# EAGLE design gps (EAGLE 6.2)
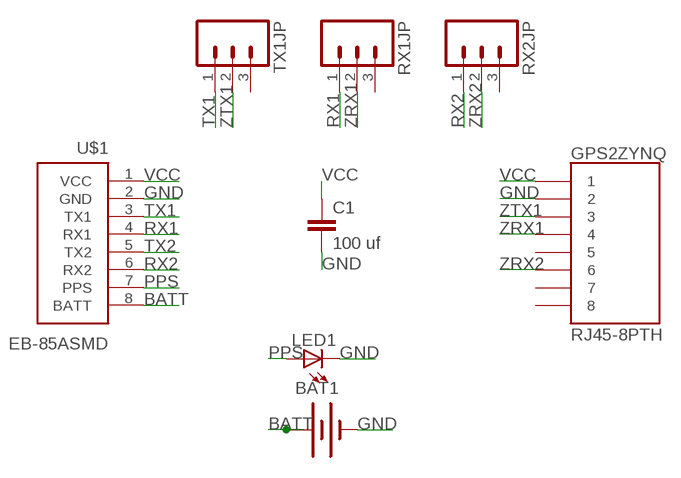
[diagram p0: schematic, sheet 1]

## Parts
BAT1  BATTERY12PTH  [BATTCON_12MM_PTH]
C1  100 uf  CAPPTH1  [CAP-PTH-5MM]
GPS2ZYNQ  RJ45-8PTH  [RJ45-8]
LED1  LED5MM  [LED5MM]
RX1JP  M03LONGPADS  [1X03_LONGPADS]
RX2JP  M03LONGPADS  [1X03_LONGPADS]
TX1JP  M03LONGPADS  [1X03_LONGPADS]
U$1  EB-85ASMD  [EB-85A]

## Nets
BATT: BAT1.VCC@1(+) U$1.8(BATT)
GND: BAT1.GND(-) C1.2 GPS2ZYNQ.2 LED1.K(C) U$1.2(GND)
PPS: LED1.A U$1.7(PPS)
RX1: RX1JP.1 U$1.4(RX1)
RX2: RX2JP.1 U$1.6(RX2)
TX1: TX1JP.1 U$1.3(TX1)
TX2: U$1.5(TX2)
VCC: C1.1 GPS2ZYNQ.1 U$1.1(VCC)
ZRX1: GPS2ZYNQ.4 RX1JP.2
ZRX2: GPS2ZYNQ.6 RX2JP.2
ZTX1: GPS2ZYNQ.3 TX1JP.2
Unconnected: GPS2ZYNQ.5 GPS2ZYNQ.7 GPS2ZYNQ.8 RX1JP.3 RX2JP.3 TX1JP.3

## Library data of the parts
BAT1 = SparkFun-Electromechanical:BATTERY: Battery Holders Various common sizes : AA, AAA, 20mm coin cell and 12mm coin cell.
C1 = SparkFun-Passives:CAP: Capacitor Standard 0603 ceramic capacitor, and 0.1" leaded capacitor.
GPS2ZYNQ = SparkFun-Connectors:RJ45-8: RJ45 Jack Simple RJ45, 8-pin connection - connector for common Cat5, Cat5e, and Cat6 Ethernet cables. Footprint not yet proven in production. Connector sku is PRT-00643; Breakout PCB sku is BOB-00716.
LED1 = SparkFun-LED:LED: LEDs Standard schematic elements and footprints for 5mm, 3mm, 1206, and 0603 sized LEDs. 5mm - Spark Fun Electronics SKU : COM-00529 (and others)
RX1JP RX2JP TX1JP = SparkFun-Connectors:M03: Header 3 Standard 3-pin 0.1" header. Use with straight break away headers (SKU : PRT-00116), right angle break away headers (PRT-00553), swiss pins (PRT-00743), machine pins (PRT-00117), and female headers (PRT-00115). Molex polarized connector foot print use with SKU : PRT-08232 with associated crimp pins and housings.
U$1 = SparkFun-Connectors:EB-85A: EB-85A Connector Proven layout and schematic for ETek 5Hz GPS receiver connector. Spark Fun Electronics SKU : GPS-08297

## Board
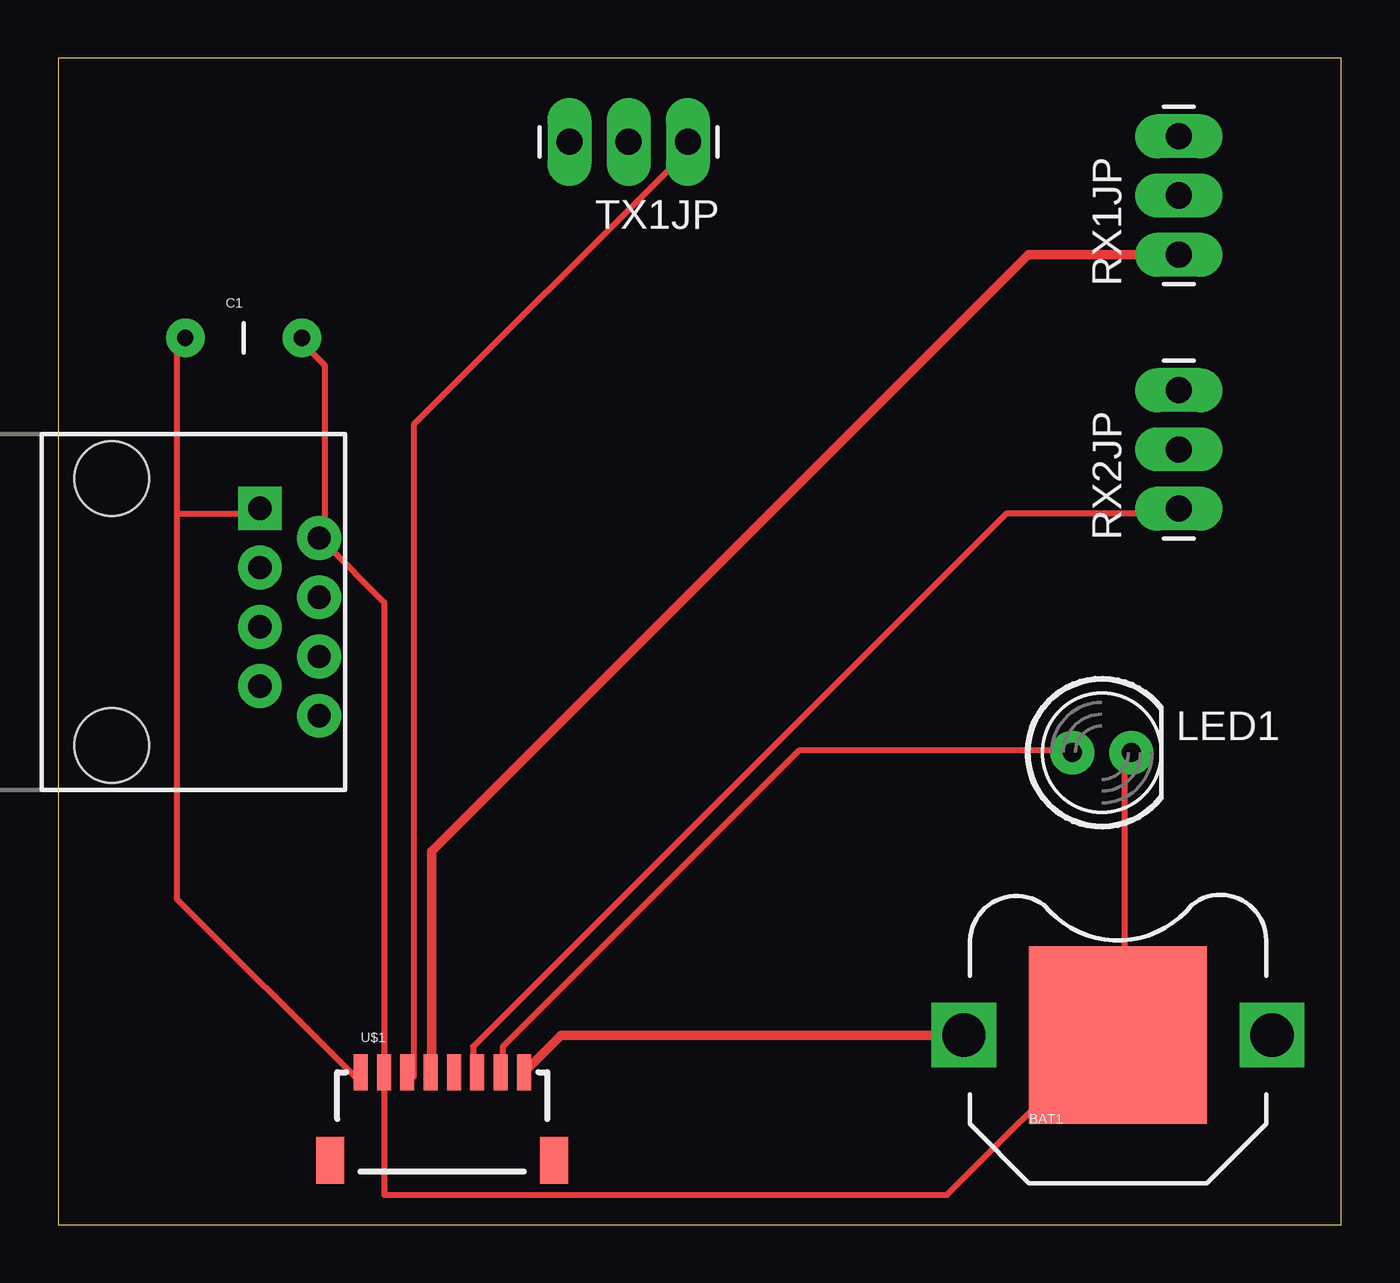
[diagram p1: board, top side]
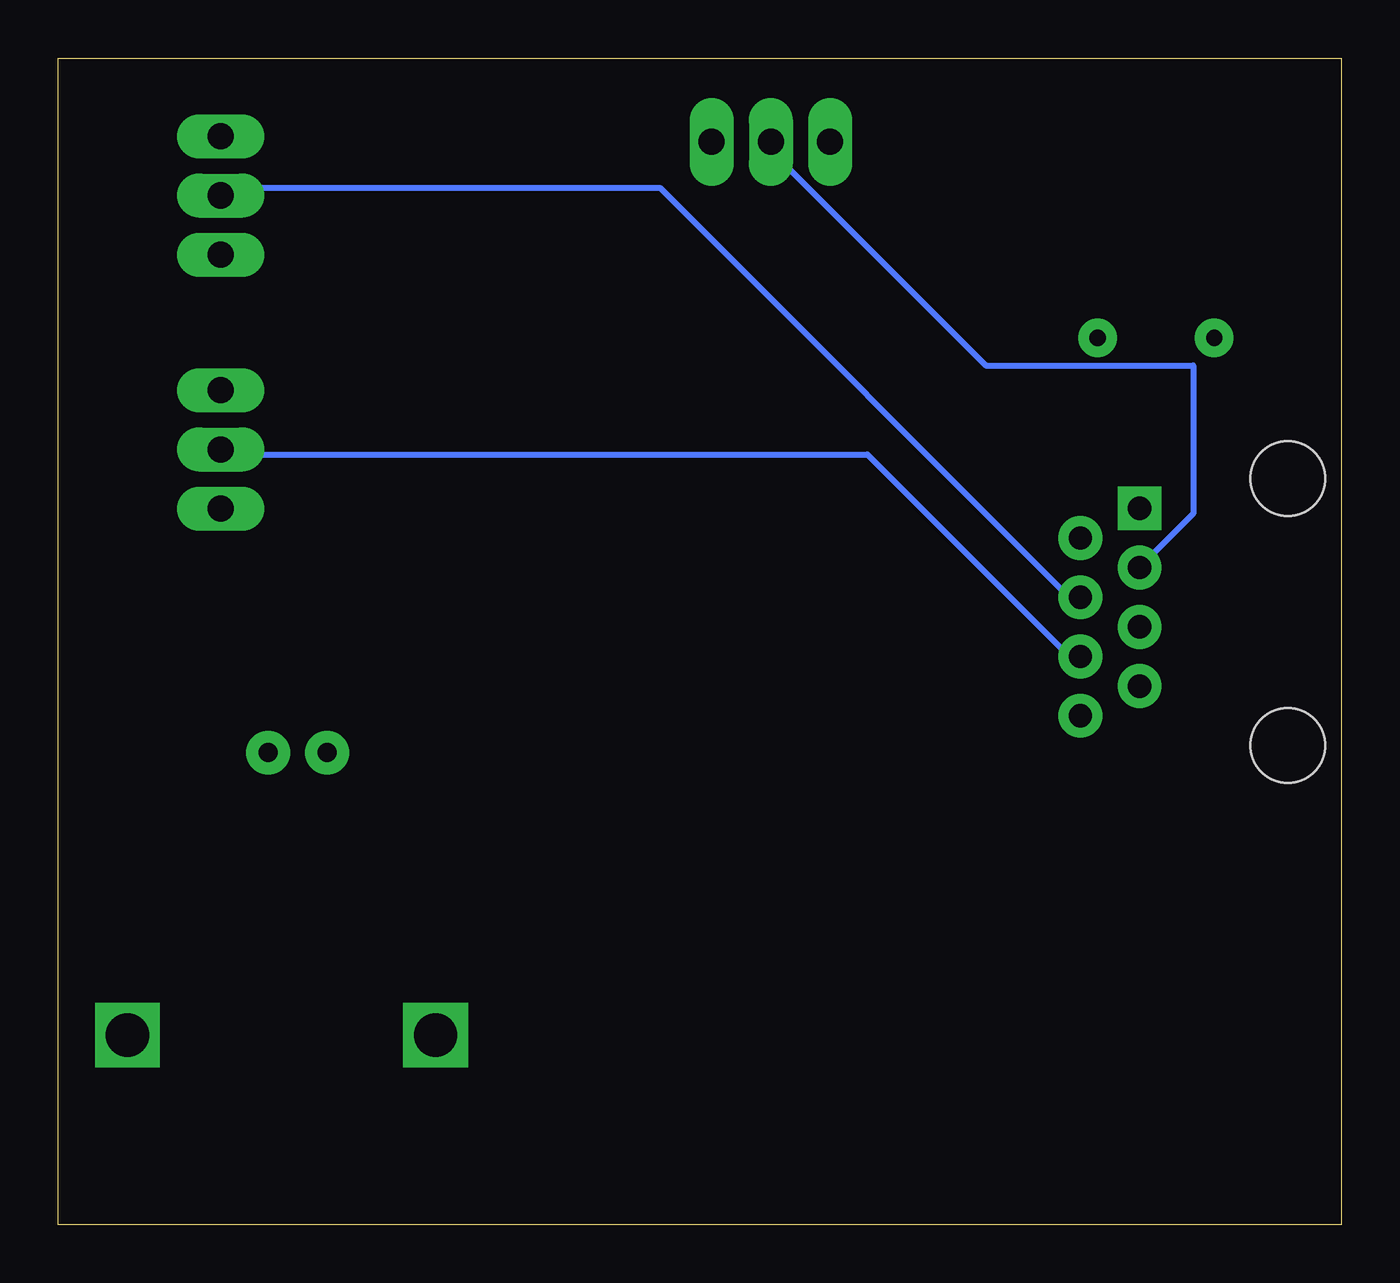
[diagram p2: board, bottom side, seen from below]

Size 55 x 50 mm. Coordinates in mm from the lower left corner, seen from the top.
Outline: 0,0 55,0 55,50 0,50 0,0
Copper layers (1*16): Top 0.035mm / dielectric 1.5mm / Bottom 0.035mm
Design rules: minimum track width 10mil, minimum drill 24mil, track to track 8mil, track to pad 8mil, pad to pad 8mil, via to via 8mil, smd to smd 8mil, copper to edge 40mil, drill to drill 8mil, minimum pad ring 10mil, minimum via ring 8mil, stop-mask expansion 4mil, vias tented up to drill 0mil, thermal gap 10mil

### Footprints (pad centres in the part's own frame; a part is rotated, then mirrored left to right if it is on the bottom)
BATTCON_12MM_PTH = smd 7.62 x 7.62: GND 0,0 | drill 1.854 square: VCC@1 -6.604,0; VCC@2 6.604,0
CAP-PTH-5MM = drill 0.7 pad 1.651: 1 -2.5,0; 2 2.5,0
RJ45-8 = drill 1 pad 1.88 square: 1 -4.445,6.35 | drill 1 pad 1.88: 2 -3.175,8.89; 3 -1.905,6.35; 4 -0.635,8.89; 5 0.635,6.35; 6 1.905,8.89; 7 3.175,6.35; 8 4.445,8.89 | hole 3.2: -5.715,0; 5.715,0
LED5MM = drill 0.813 pad 1.88: A -1.27,0; K 1.27,0
1X03_LONGPADS = drill 1.118 pad 1.88 long: 1 0,0; 2 2.54,0; 3 5.08,0
EB-85A = smd 0.6 x 1.55: 1 0,0; 2 1,0; 3 2,0; 4 3,0; 5 4,0; 6 5,0; 7 6,0; 8 7,0 | smd 1.2 x 2: P$1 -1.3,-3.775; P$2 8.3,-3.775

### Placement (x,y rotation side)
BAT1  45.43,8.12 0 top
C1  7.94,38.02 0 top
GPS2ZYNQ  2.29,26.26 270 top
LED1  44.74,20.23 0 top
RX1JP  48.04,41.58 90 top
RX2JP  48.04,30.69 90 top
TX1JP  26.99,46.42 180 top
U$1  12.96,6.53 0 top

### Tracks (layer width: path | path; a pad name or v marks a point on that pad's centre or on a via)
BATT
  Top 0.406: BAT1.VCC@1 21.55,8.12 U$1.8
GND
  Top 0.254: LED1.K 45.72,20.32 45.72,8.89 BAT1.GND 44.45,7.62 38.1,1.27 13.97,1.27 13.97,6.35 | 13.97,6.35 13.97,26.67 11.43,29.21 | 11.43,29.21 11.43,36.83 10.16,38.1 C1.2 | 11.43,29.21 GPS2ZYNQ.2 | 13.97,6.35 U$1.2
PPS
  Top 0.254: U$1.7 19.05,6.35 19.05,7.62 31.75,20.32 43.18,20.32 LED1.A
RX1
  Top 0.406: RX1JP.1 41.58,41.58 16,16 16,6.57 U$1.4
RX2
  Top 0.254: U$1.6 17.78,6.35 17.78,7.62 40.64,30.48 46.99,30.48 RX2JP.1
TX1
  Top 0.254: U$1.3 15.24,6.35 15.24,34.29 26.67,45.72 TX1JP.1
VCC
  Top 0.254: 5.08,30.48 5.08,38.1 C1.1 | 5.08,30.48 5.08,13.97 12.7,6.35 U$1.1 | 5.08,30.48 8.89,30.48 GPS2ZYNQ.1
ZRX1
  Bottom 0.254: GPS2ZYNQ.4 11.43,26.67 29.21,44.45 46.99,44.45 RX1JP.2
ZRX2
  Bottom 0.254: GPS2ZYNQ.6 11.43,24.13 20.32,33.02 46.99,33.02 RX2JP.2
ZTX1
  Bottom 0.254: GPS2ZYNQ.3 8.89,27.94 6.35,30.48 6.35,36.83 15.24,36.83 24.13,45.72 TX1JP.2